# Altium schematic sheet DIGITAL_OUTPUT1.SchDoc
size A4; SheetNumber: 6; SheetTotal: 16
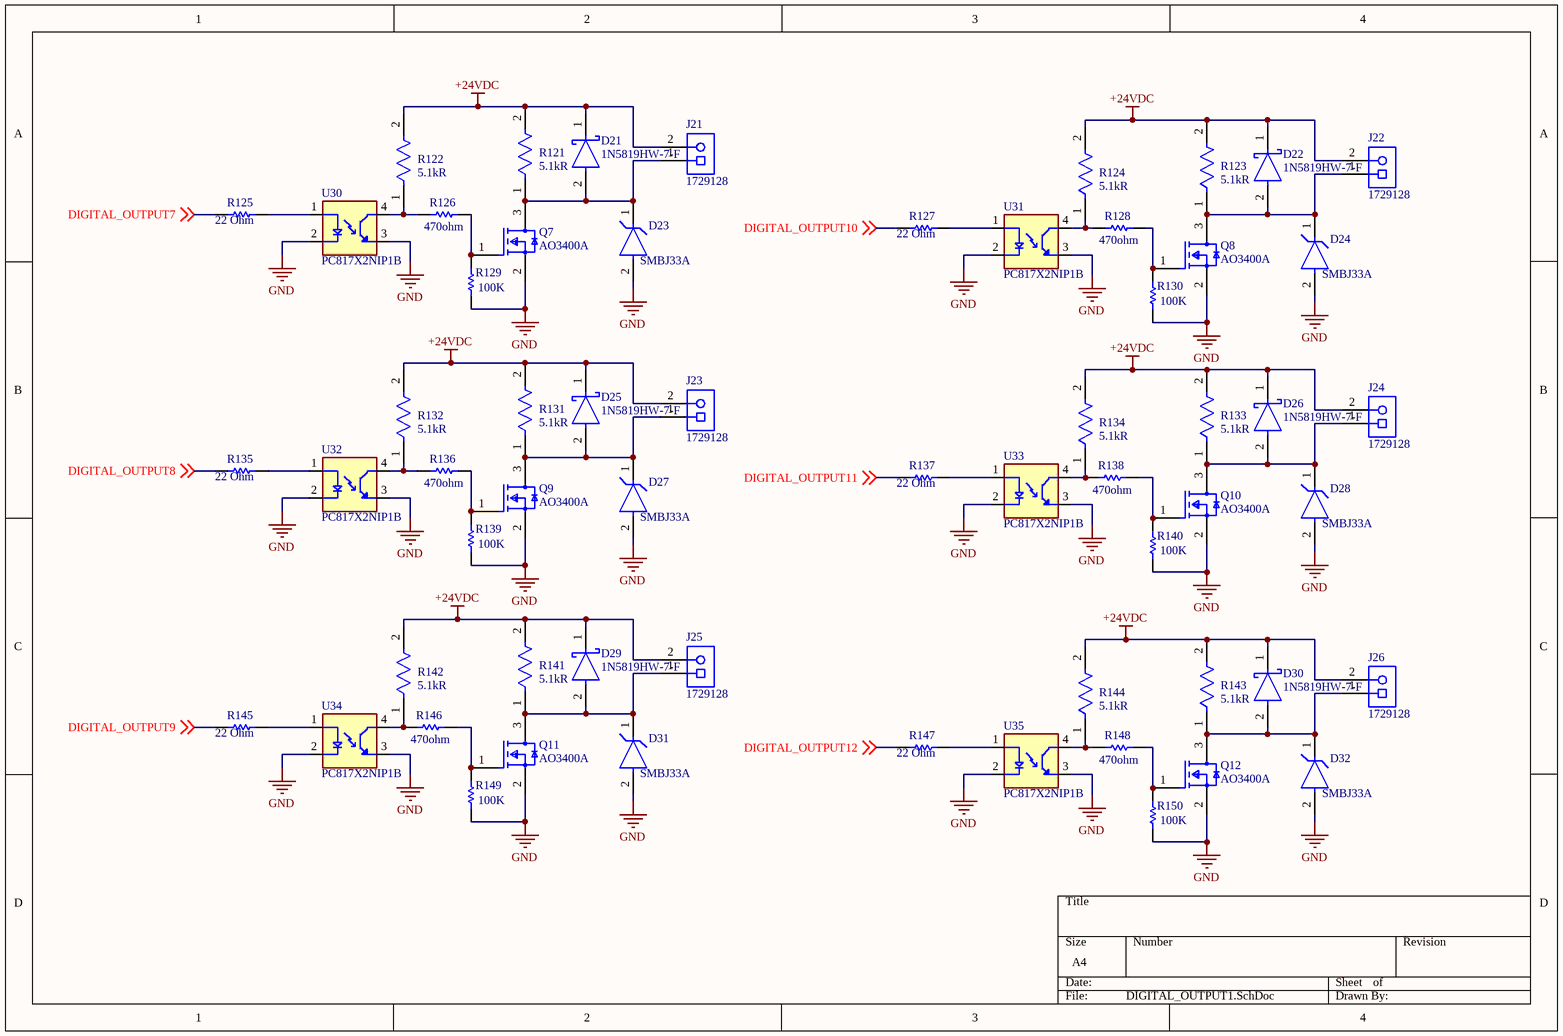
[diagram p0: DIGITAL_OUTPUT1.SchDoc]

## Parts
D21  1N5819HW-7-F  [FP-SOD123-IPC_A]
D22  1N5819HW-7-F  [FP-SOD123-IPC_A]
D23  SMBJ33A  [FP-SMBJ-MFG]
D24  SMBJ33A  [FP-SMBJ-MFG]
D25  1N5819HW-7-F  [FP-SOD123-IPC_A]
D26  1N5819HW-7-F  [FP-SOD123-IPC_A]
D27  SMBJ33A  [FP-SMBJ-MFG]
D28  SMBJ33A  [FP-SMBJ-MFG]
D29  1N5819HW-7-F  [FP-SOD123-IPC_A]
D30  1N5819HW-7-F  [FP-SOD123-IPC_A]
D31  SMBJ33A  [FP-SMBJ-MFG]
D32  SMBJ33A  [FP-SMBJ-MFG]
J21  1729128  [PHOE-1729128-2_V]
J22  1729128  [PHOE-1729128-2_V]
J23  1729128  [PHOE-1729128-2_V]
J24  1729128  [PHOE-1729128-2_V]
J25  1729128  [PHOE-1729128-2_V]
J26  1729128  [PHOE-1729128-2_V]
Q7  AO3400A  [FP-SOT23-MFG]
Q8  AO3400A  [FP-SOT23-MFG]
Q9  AO3400A  [FP-SOT23-MFG]
Q10  AO3400A  [FP-SOT23-MFG]
Q11  AO3400A  [FP-SOT23-MFG]
Q12  AO3400A  [FP-SOT23-MFG]
R121  Resistance: 5.1kR  [FP-CRCW0603-e3-IPC_C]  (hidden comment: CRCW06035K10FKEA)
R122  Resistance: 5.1kR  [FP-CRCW0603-e3-IPC_C]  (hidden comment: CRCW06035K10FKEA)
R123  Resistance: 5.1kR  [FP-CRCW0603-e3-IPC_C]  (hidden comment: CRCW06035K10FKEA)
R124  Resistance: 5.1kR  [FP-CRCW0603-e3-IPC_C]  (hidden comment: CRCW06035K10FKEA)
R125  Resistance: 22 Ohm  [RESC1608X55X30LL15T15]  (hidden comment: ERJ-3EKF2200V)
R126  Resistance: 470ohm  [RESC2013X60X35LL10T20]  (hidden comment: RC0805FR-07470RL)
R127  Resistance: 22 Ohm  [RESC1608X55X30LL15T15]  (hidden comment: ERJ-3EKF2200V)
R128  Resistance: 470ohm  [RESC2013X60X35LL10T20]  (hidden comment: RC0805FR-07470RL)
R129  value 100K  [RESC2013X50X30ML20T20]  (hidden comment: CRCW0805100KJNEA)
R130  value 100K  [RESC2013X50X30ML20T20]  (hidden comment: CRCW0805100KJNEA)
R131  Resistance: 5.1kR  [FP-CRCW0603-e3-IPC_C]  (hidden comment: CRCW06035K10FKEA)
R132  Resistance: 5.1kR  [FP-CRCW0603-e3-IPC_C]  (hidden comment: CRCW06035K10FKEA)
R133  Resistance: 5.1kR  [FP-CRCW0603-e3-IPC_C]  (hidden comment: CRCW06035K10FKEA)
R134  Resistance: 5.1kR  [FP-CRCW0603-e3-IPC_C]  (hidden comment: CRCW06035K10FKEA)
R135  Resistance: 22 Ohm  [RESC1608X55X30LL15T15]  (hidden comment: ERJ-3EKF2200V)
R136  Resistance: 470ohm  [RESC2013X60X35LL10T20]  (hidden comment: RC0805FR-07470RL)
R137  Resistance: 22 Ohm  [RESC1608X55X30LL15T15]  (hidden comment: ERJ-3EKF2200V)
R138  Resistance: 470ohm  [RESC2013X60X35LL10T20]  (hidden comment: RC0805FR-07470RL)
R139  value 100K  [RESC2013X50X30ML20T20]  (hidden comment: CRCW0805100KJNEA)
R140  value 100K  [RESC2013X50X30ML20T20]  (hidden comment: CRCW0805100KJNEA)
R141  Resistance: 5.1kR  [FP-CRCW0603-e3-IPC_C]  (hidden comment: CRCW06035K10FKEA)
R142  Resistance: 5.1kR  [FP-CRCW0603-e3-IPC_C]  (hidden comment: CRCW06035K10FKEA)
R143  Resistance: 5.1kR  [FP-CRCW0603-e3-IPC_C]  (hidden comment: CRCW06035K10FKEA)
R144  Resistance: 5.1kR  [FP-CRCW0603-e3-IPC_C]  (hidden comment: CRCW06035K10FKEA)
R145  Resistance: 22 Ohm  [RESC1608X55X30LL15T15]  (hidden comment: ERJ-3EKF2200V)
R146  Resistance: 470ohm  [RESC2013X60X35LL10T20]  (hidden comment: RC0805FR-07470RL)
R147  Resistance: 22 Ohm  [RESC1608X55X30LL15T15]  (hidden comment: ERJ-3EKF2200V)
R148  Resistance: 470ohm  [RESC2013X60X35LL10T20]  (hidden comment: RC0805FR-07470RL)
R149  value 100K  [RESC2013X50X30ML20T20]  (hidden comment: CRCW0805100KJNEA)
R150  value 100K  [RESC2013X50X30ML20T20]  (hidden comment: CRCW0805100KJNEA)
U30  PC817X2NIP1B  [SOIC254P960X420-4N]
U31  PC817X2NIP1B  [SOIC254P960X420-4N]
U32  PC817X2NIP1B  [SOIC254P960X420-4N]
U33  PC817X2NIP1B  [SOIC254P960X420-4N]
U34  PC817X2NIP1B  [SOIC254P960X420-4N]
U35  PC817X2NIP1B  [SOIC254P960X420-4N]

## Nets
+24VDC: D21.1(C) D22.1(C) D25.1(C) D26.1(C) D29.1(C) D30.1(C) J21.2 J22.2 J23.2 J24.2 J25.2 J26.2 R121.2 R122.2 R123.2 R124.2 R131.2 R132.2 R133.2 R134.2 R141.2 R142.2 R143.2 R144.2
GND: D23.2(A) D24.2(A) D27.2(A) D28.2(A) D31.2(A) D32.2(A) Q7.2(S) Q8.2(S) Q9.2(S) Q10.2(S) Q11.2(S) Q12.2(S) R129.1 R130.1 R139.1 R140.1 R149.1 R150.1 U30.2(C) U30.3(ET) U31.2(C) U31.3(ET) U32.2(C) U32.3(ET) U33.2(C) U33.3(ET) U34.2(C) U34.3(ET) U35.2(C) U35.3(ET)
DIGITAL_OUTPUT7: R125.1 ; off-sheet DIGITAL_OUTPUT7
DIGITAL_OUTPUT8: R135.1 ; off-sheet DIGITAL_OUTPUT8
DIGITAL_OUTPUT9: R145.1 ; off-sheet DIGITAL_OUTPUT9
DIGITAL_OUTPUT10: R127.1 ; off-sheet DIGITAL_OUTPUT10
DIGITAL_OUTPUT11: R137.1 ; off-sheet DIGITAL_OUTPUT11
DIGITAL_OUTPUT12: R147.1 ; off-sheet DIGITAL_OUTPUT12
NetD21_2: D21.2(A) D23.1(C) J21.1 Q7.3(D) R121.1
NetD22_2: D22.2(A) D24.1(C) J22.1 Q8.3(D) R123.1
NetD25_2: D25.2(A) D27.1(C) J23.1 Q9.3(D) R131.1
NetD26_2: D26.2(A) D28.1(C) J24.1 Q10.3(D) R133.1
NetD29_2: D29.2(A) D31.1(C) J25.1 Q11.3(D) R141.1
NetD30_2: D30.2(A) D32.1(C) J26.1 Q12.3(D) R143.1
NetQ7_1: Q7.1(G) R126.2 R129.2
NetQ8_1: Q8.1(G) R128.2 R130.2
NetQ9_1: Q9.1(G) R136.2 R139.2
NetQ10_1: Q10.1(G) R138.2 R140.2
NetQ11_1: Q11.1(G) R146.2 R149.2
NetQ12_1: Q12.1(G) R148.2 R150.2
NetR122_1: R122.1 R126.1 U30.4(CT)
NetR124_1: R124.1 R128.1 U31.4(CT)
NetR125_2: R125.2 U30.1(A)
NetR127_2: R127.2 U31.1(A)
NetR132_1: R132.1 R136.1 U32.4(CT)
NetR134_1: R134.1 R138.1 U33.4(CT)
NetR135_2: R135.2 U32.1(A)
NetR137_2: R137.2 U33.1(A)
NetR142_1: R142.1 R146.1 U34.4(CT)
NetR144_1: R144.1 R148.1 U35.4(CT)
NetR145_2: R145.2 U34.1(A)
NetR147_2: R147.2 U35.1(A)

## Library data of the parts
D21 D22 D25 D26 D29 D30 = CMP-0303-00003-3: DIODE SCHOTTKY 40V 1A SOD123; Forward Voltage: 450mV; Capacitance: 110pF; Max Forward Surge Current (Ifsm): 25A; Peak Reverse Current: 50uA; Polarity: Standard; Element Configuration: Single; Max Power Dissipation: 450mW; Min Operating Temperature: -65°C; Package Quantity: 3000; Contact Plating: Tin; Weight: 0.000353oz; Max Repetitive Reverse Voltage (Vrrm): 40V; Max Reverse Voltage (DC): 40V; Height: 1.25mm; Average Rectified Current: 1A; Width: 1.7mm; Case/Package: SOD-123-2; Lead Free: Lead Free; Max Operating Temperature: 125°C; Current Rating: 1A; Termination: SMD/SMT; Forward Current: 1A; Radiation Hardening: No; Number of Pins: 2; Length: 2.85mm; Voltage Rating (DC): 40V; REACH SVHC: No SVHC; Peak Non-Repetitive Surge Current: 25A; Packaging: Tape and Reel; Output Current: 1A
D23 D24 D27 D28 D31 D32 = CMP-2000-07095-2: TVS DIODE 33V 53.3V DO214AA; Manufacturer: Littelfuse Inc; Max Junction Temp: +150°C; Number Of Channels: 1; Breakdown Voltage: 36.7V; Peak Pulse Power: 600W; Direction: Unidirectional; Peak Pulse Current: 11.3A; Lead Free: Yes; Height: 2.61mm; Temperature Range Low: -65°C; ComponentLink2URL: https://www.littelfuse.com/~/media/electronics/datasheets/tvs_diodes/littelfuse_tvs_diode_smbj_datasheet.pdf.pdf; Manufacturer Part Number: SMBJ33A; Clamping Voltage: 53.3V; Device Class L1: Circuit Protection; Octopart: https://octopart.com/smbj33a-littelfuse-350829; Device Class L2: TVS Diodes; Digikey Description: TVS DIODE 33V 53.3V DO214AA; Automotive: No; Temperature Range High: +150°C; Package: SMBJ; ComponentLink2Description: Datasheet; Mouser Description: TVS DIODE 33V 53.3V DO214AA; Reverse Standoff Voltage: 33V; Category: Diode; Device Class L3: unset; Temperature: -65°C to +150°C; RoHS: TRUE
J21-J26 = CMP-2000-05815-1: PCB Terminal Block, 13.5 A, 400 V, 2-Pin THD, RoHS, Bulk; Manufacturer: Phoenix Contact; Package Version: 03/2015; No. of Rows: 1; Pitch: 5.08mm; No. of Positions: 2; Voltage Rating: 400V; Current Rating: 13500mA; Manufacturer URL: http://www.phoenixcontact.com/; Datasheet URL: https://datasheet.ciiva.com/16046/1729128-16046181.pdf; RoHS: TRUE; Package URL: https://www.phoenixcontact.com/online/portal/pi/pxc/product_detail_page/!ut/p/b1/3VdJjqNKFDxLH8AFycySyWY2ozFsEPOMMQaDOX1XedGL_1Vdm5YXJleknhSKeBkvI6EA8ncAo3AYoDhBQGco6KN7VURTdemj9us_IEKEZo_YHiPAEWEFmDGOHMORkqKYCORBZxgL7ZoaZYcbFFUZ3fqxSY6GOuxydWUuHqz1ynmMFygu583Bob0Ewr6Sd_l-5m-kAueHiB0jpRwZwe58wwtkpxtMYd_LmGcDRU02dRNEyWt6Y2ti5pSyJ_reIkzIulrqApdnbT11V5jnCKbYNCvhEM1MCpPByat_X379-iThf08CI5GfOPqfBeS3BRoBOdD55AKVv0iLwCMq-2BrzXWSGRH7pUGD9uwXQjiph3xL0DKQwdGa0JImiIOmBNOestqgwTHSSs2oOep-78apyXQBvNi8ZLaFjvjWvcaUEBu0MC6Wbe-d6mB0FAebo2lUWinqYaZs5DAYzV0RP9yitUjnGJ0iI9xhZkT42OCQNUJJhkgWINNQLP2JFP6OpMg3JCVg70jqHT0lvKOnhHf0lPuOnnLf0VPuWx6_dxwUIvwk5WMkT0kLL1mh61l2yZVSzG3pYV_bqo-mj6uMKwKwdnnW8Jh5RTOJzMOA5c-eJDaZQw4mTMPH02PvS_ZAqNVjVTo2WyYLkwH_KU1mmmG5kjRhDqPXLwwVHvVOjCM60-fpXvTDfMGW1PVFVS1r4e4yVDk4ZdNbkUHvqPqQSeian4UD39fNKmachqdJ1NJbyk8rXT9mXTvPk3oE5meulKGgiruPJek-4I9hTT6G8ZLOyRSm2RRVbThERQad5OS28hdt4YW4vG0stgYYzsWsK4_7y6DZMjJSCqri1kyiZR5vD7pwIrNR7QwPHTcLTI5qT7eRlpHrdGiupYlqQDJ7zy_CND8fWWBoLRXxk1RVcXiBQwbTD4Xi7KL-FuO94t9xaqweXzH; PartNumber: 1729128; Package Description: 2-Pin Through Hole Device, Body 8.1 x 10.16 mm, Pitch 5.08 mm; Datasheet Version: 12/2013; Mounting Technology: ThroughHole; Orientation: Horizontal; Package Reference: 1729128-2; Packing: Bulk
Q7-Q12 = CMP-83955-000006-1: MOSFET N-CH 30V 5.7A SOT23; Input Capacitance: 630pF; Number of Elements: 1; Rds On Max: 26.5mR; Max Power Dissipation: 1.4W; Gate to Source Voltage (Vgs): 12V; Min Operating Temperature: -55°C; Lead Free: Lead Free; Number of Pins: 3; Drain to Source Voltage (Vdss): 30V; Case/Package: SOT-23; Mount: Surface Mount; Continuous Drain Current (ID): 5.7A; Radiation Hardening: No; Packaging: Tape and Reel; Max Operating Temperature: 150°C; Power Dissipation: 1.4W
R121-R124 R131-R134 R141-R144 = CMP-1012-00590-3: RES Thick Film, 5.1kΩ, 1%, 0.1W, 100ppm/°C, 0603; Power Rating: 100mW; Voltage Rating (DC): 75V; Width: 0.85mm; Depth: 0.85mm; Military Standard: Not; Package Quantity: 5000; Case Code (Metric): 1608; Length: 1.55mm; Weight: 7.1E-05oz; Packaging: Tape and Reel; Temperature Coefficient: 100ppm/°C; Case Code (Imperial): 0603; Lead Free: Lead Free; Radiation Hardening: No; Contact Plating: Tin; Composition: Thick Film; Max Operating Temperature: 155°C; Termination: SMD/SMT; Case/Package: 0603; Min Operating Temperature: -55°C; Tolerance: 1%; Voltage Rating: 75V; Mount: Surface Mount; Height: 0.45mm
R125 R127 R135 R137 R145 R147 = CMP-2000-00335-2: Chip Resistor, 220 Ohm, +/- 1%, 0.1 W, -55 to 155 degC, 0603 (1608 Metric), RoHS, Tape and Reel; Voltage Rating: 50 V; Power Rating: 100 mW; Case\Package: 0603; ComponentLink2Description: Datasheet; PackageDescription: 2-Pin Surface Mount Device, Body 1.6 x 0.85 mm; PackageReference: 0603; ComponentLink1Description: Manufacturer URL; ComponentLink2URL: http://industrial.panasonic.com/cdbs/www-data/pdf/RDA0000/AOA0000C86.pdf; Height: 0.45 mm; Mount: Surface Mount; Case Code (Metric): 1608; Pins: 2; Width: 0.8 mm; Length: 1.6 mm; Package Quantity: 5000; Tolerance: 1%; ComponentLink1URL: http://www.panasonic.com/; Max Operating Temperature: 155 degC; Min Operating Temperature: -55 degC; RoHSCompliant: true; Packaging: Tape and Reel; Case Code (Imperial): 0603; DatasheetVersion: Apr-15; REACH SVHC: No SVHC; Voltage Rating (DC): 50 V
R126 R128 R136 R138 R146 R148 = CMP-2000-06961-1: Chip Resistor, 470 Ohm, +/- 1%, 125 mW, -55 to 155 degC, 0805 (2012 Metric), RoHS, Tape and Reel; Manufacturer: Yageo; Power Rating: 250mW; Resistor Case Style: 0805[2012Metric]; Voltage Rating: 150V; Resistor Element Type: ThickFilm; Temperature Coefficient: ±100ppm/°C; SVHC: ToBeAdvised; Datasheet Version: Rev. 7, 05/2017; Automotive Qualification Standard: -; Mounting Technology: SurfaceMount; Product Range: -; Packaging: Tape&Reel; Package Description: 2-Pin Surface Mounted Device, Body 2 x 1.25 mm; MSL: MSL1-Unlimited; Package Reference: 0805; Resistance Tolerance: ±1%; Datasheet URL: http://www.yageo.com/documents/recent/PYu-RC_Group_51_RoHS_L_7.pdf; Manufacturer URL: http://www.yageo.com/
R129 R130 R139 R140 R149 R150 = CMP-2001-04900-1: Manufacturer: Vishay Dale; Part Number: CRCW0805100KJNEA
U30-U35 = PC817X2NIP1B: Optocoupler DC-IN 1-CH Transistor DC-OUT 4-Pin DIP SMD T/R; MF: Sharp Microelectronics; SnapEDA_Link: https://www.snapeda.com/parts/PC817X2NIP1B/Sharp+Microelectronics/view-part/?ref=snap; Package: SMD-4 Sharp Microelectronics; Value: *; MP: PC817X2NIP1B; Check_prices: https://www.snapeda.com/parts/PC817X2NIP1B/Sharp+Microelectronics/view-part/?ref=eda